# Altium schematic sheet Control.SchDoc: =ProjectName
size A4; CheckedBy: DatNB; Author: Ven; CompanyName: Nacentech; Organization: IMET
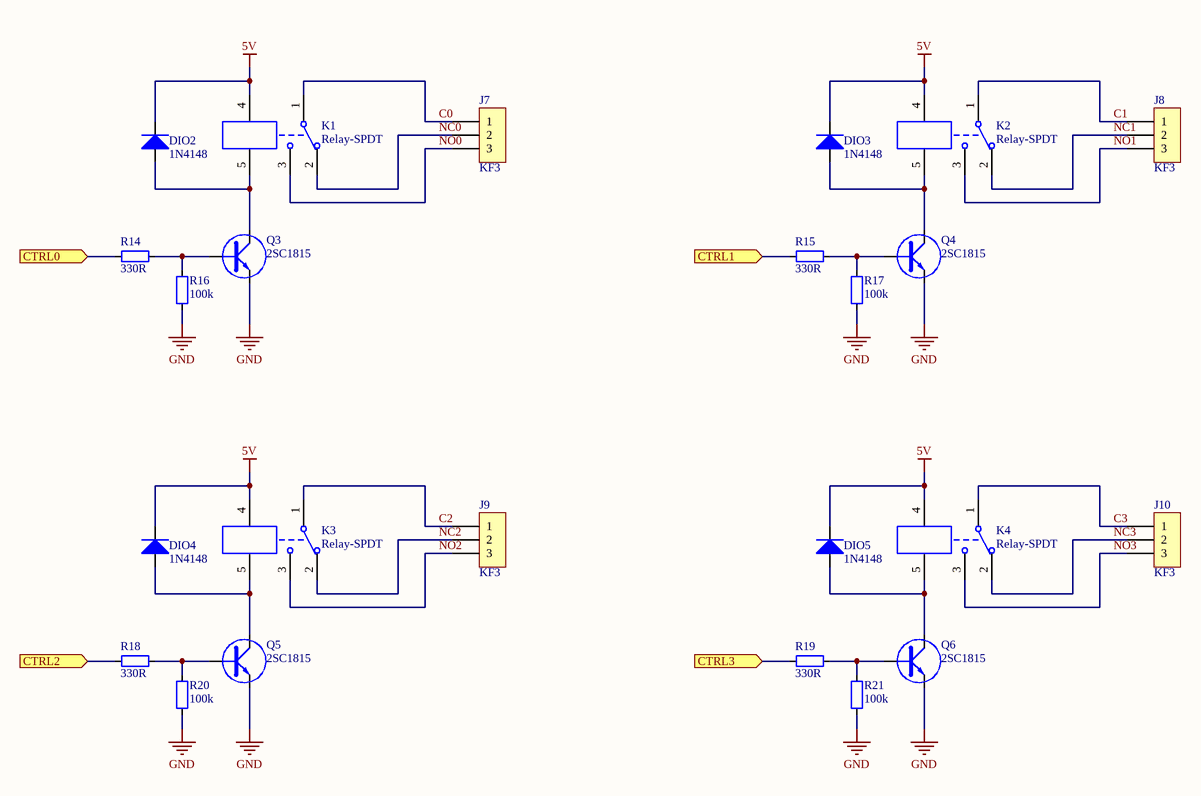
[diagram p0: Control.SchDoc]

## Parts
DIO2  1N4148  [DIO-SMD-106]
DIO3  1N4148  [DIO-SMD-106]
DIO4  1N4148  [DIO-SMD-106]
DIO5  1N4148  [DIO-SMD-106]
J7  KF3  [KF3-5.08]
J8  KF3  [KF3-5.08]
J9  KF3  [KF3-5.08]
J10  KF3  [KF3-5.08]
K1  Relay-SPDT  [RELAY5PIN-10A]
K2  Relay-SPDT  [RELAY5PIN-10A]
K3  Relay-SPDT  [RELAY5PIN-10A]
K4  Relay-SPDT  [RELAY5PIN-10A]
Q3  2SC1815  [SOT23]
Q4  2SC1815  [SOT23]
Q5  2SC1815  [SOT23]
Q6  2SC1815  [SOT23]
R14  330R  [RES-SMD-0805]
R15  330R  [RES-SMD-0805]
R16  100k  [RES-SMD-0805]
R17  100k  [RES-SMD-0805]
R18  330R  [RES-SMD-0805]
R19  330R  [RES-SMD-0805]
R20  100k  [RES-SMD-0805]
R21  100k  [RES-SMD-0805]

## Ports
CTRL0 (in), CTRL1 (in), CTRL2 (in), CTRL3 (in)

## Nets
5V: DIO2.2(K) DIO3.2(K) DIO4.2(K) DIO5.2(K) K1.4 K2.4 K3.4 K4.4
GND: Q3.3(E) Q4.3(E) Q5.3(E) Q6.3(E) R16.1 R17.1 R20.1 R21.1
C0: J7.1 K1.1
C1: J8.1 K2.1
C2: J9.1 K3.1
C3: J10.1 K4.1
CTRL0: R14.1 ; port CTRL0
CTRL1: R15.1 ; port CTRL1
CTRL2: R18.1 ; port CTRL2
CTRL3: R19.1 ; port CTRL3
NC0: J7.2 K1.2
NC1: J8.2 K2.2
NC2: J9.2 K3.2
NC3: J10.2 K4.2
NO0: J7.3 K1.3
NO1: J8.3 K2.3
NO2: J9.3 K3.3
NO3: J10.3 K4.3
NetDIO2_1: DIO2.1(A) K1.5 Q3.2(C)
NetDIO3_1: DIO3.1(A) K2.5 Q4.2(C)
NetDIO4_1: DIO4.1(A) K3.5 Q5.2(C)
NetDIO5_1: DIO5.1(A) K4.5 Q6.2(C)
NetQ3_1: Q3.1(B) R14.2 R16.2
NetQ4_1: Q4.1(B) R15.2 R17.2
NetQ5_1: Q5.1(B) R18.2 R20.2
NetQ6_1: Q6.1(B) R19.2 R21.2

## Notes on the sheet
- Project:
- Page Contents:
- Size:
- Date:
- A4
- Checked by:
- Time:
- Revision:
- Sheet
- of
- File:

## Library data of the parts
DIO2-DIO5 = Diode SMD: Default Diode; Code - JEDEC: DO-214-AB; Value: 1N5007; Published: 8-Jun-2000; Revision: July-2002: Re-released for DXP Platform.; Publisher: Altium Limited
J7-J10 = KF3: Manufacturer: Würth Elektronik eiSos GmbH; partNo: 691103110003; ComponentLink1 Description: Manufacturer; ComponentLink2 Description: Datasheet; NoPins: 3; Created Date: 29 October 2013; ComponentLink1URL: http://www.we-online.com; ComponentLink2URL: http://katalog.we-online.de/em/datasheet/6911031100xx.pdf; Created by: Karrer Zheng
K1-K4 = Relay-SPDT: Single-Pole Dual-Throw Relay; Published: 24-Mar-1999; LatestRevisionDate: 17-Jul-2002; LatestRevisionNote: Re-released for DXP Platform.; PackageReference: MODULE5B; Publisher: Altium Limited
Q3-Q6 = 2SC1815: NPN 600mW, ECB; Value: C1815
R14-R21 = Resistor - SMD: Resistor; Manufacturer: Generic Components; Class: Passive; Published: 08/06/2000; Publisher: Altium Hobart Technology Centre